# Altium schematic sheet Transformer FrontEnd 2.SchDoc
size A4
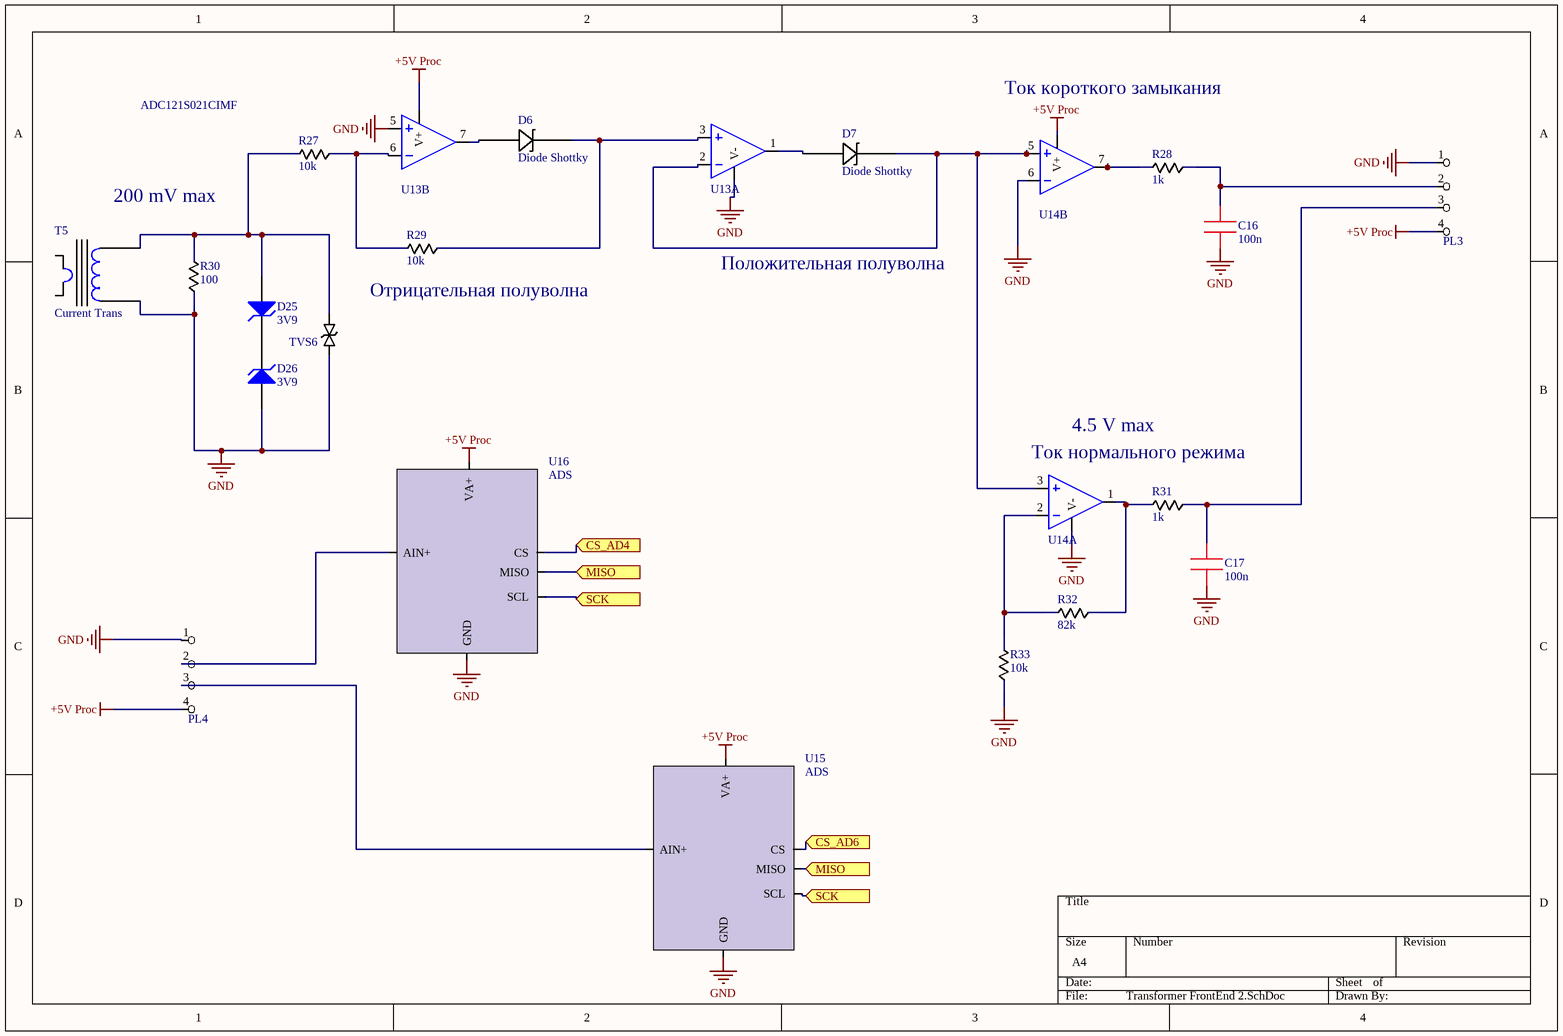
[diagram p0: Transformer FrontEnd 2.SchDoc]

## Parts
C16  100n  [0603]
C17  100n  [0603]
D6  Diode Shottky  [SOD523]
D7  Diode Shottky  [SOD523]
D25  3V9  [SOD80C]
D26  3V9  [SOD80C]
PL3  plug  [PLS 4]  (value not drawn)
PL4  plug  [PLS 4]  (value not drawn)
R27  10k  [0603]
R28  1k  [0603]
R29  10k  [0603]
R30  100  [1206]
R31  1k  [0603]
R32  82k  [0603]
R33  10k  [0603]
T5  Current Trans  [Talema]
TVS6  SMAJ5.0CA  [DO-214AC]  (value not drawn)
U13  OPAMP 2Ch  [SOIC 8]  (value not drawn)  (parts A,B of 2)
U14  OPAMP 2Ch  [SOIC 8]  (value not drawn)  (parts A,B of 2)
U15  ADS  [SOT23 - 6]
U16  ADS  [SOT23 - 6]

## Ports
CS_AD4, CS_AD6, MISO, SCK

## Nets
+5V Proc: PL3.4 PL4.4 U13.8(V+) U14.8(V+) U15.1(VA+) U16.1(VA+)
GND: C16.1 C17.1 D26.1(A) PL3.1 PL4.1 R30.1 R33.1 T5.2 TVS6.1 U13.4(V-) U13.5(+IN) U14.4(V-) U14.6(-IN) U15.2(GND) U16.2(GND)
CS_AD4: U16.6(CS) ; port CS_AD4
CS_AD6: U15.6(CS) ; port CS_AD6
MISO: U15.5(MISO) U16.5(MISO) ; port MISO
SCK: U15.4(SCL) U16.4(SCL) ; port SCK
NetC16_2: C16.2 PL3.2 R28.1
NetC17_2: C17.2 PL3.3 R31.1
NetD6_1: D6.1 U13.7(OUT)
NetD6_2: D6.2 R29.1 U13.3(+IN)
NetD7_1: D7.1 U13.1(OUT)
NetD7_2: D7.2 U13.2(-IN) U14.3(+IN) U14.5(+IN)
NetD25_1: D25.1(A) R27.2 R30.2 T5.1 TVS6.2
NetD25_2: D25.2(K) D26.2(K)
NetPL4_2: PL4.2 U16.3(AIN+)
NetPL4_3: PL4.3 U15.3(AIN+)
NetR27_1: R27.1 R29.2 U13.6(-IN)
NetR28_2: R28.2 U14.7(OUT)
NetR31_2: R31.2 R32.1 U14.1(OUT)
NetR32_2: R32.2 R33.2 U14.2(-IN)

## Notes on the sheet
- ADC121S021CIMF
- Ток короткого замыкания
- 200 mV max
- Отрицательная полуволна
- Положительная полуволна
- 4.5 V max
- Ток нормального режима

## Library data of the parts
C16 C17 = 0603 CAP: CC0603KRX7R9BB104
D6 D7 = Diode Shottky: RB751S40T1G
D25 D26 = D Zener: BZV55-C3V9,115
PL3 PL4 = PLS-4R: PLS-4R (DS1022-1x4R)
R27 R29 R33 = 0603 RES: RT0603FRE0710KL
R28 R31 = 0603 RES: RC0603FR-071KL
R30 = SMD Resistor: RT1206BRD07100RL
R32 = 0603 RES: ERJ3EKF8202V
T5 = Current Trans: AC-1005
U13 U14 = OPAMP 2Ch: TS272IDT
U15 U16 = ADS: ADC121S021CIMF